# EAGLE design Ethernet J11D (EAGLE 5.04)
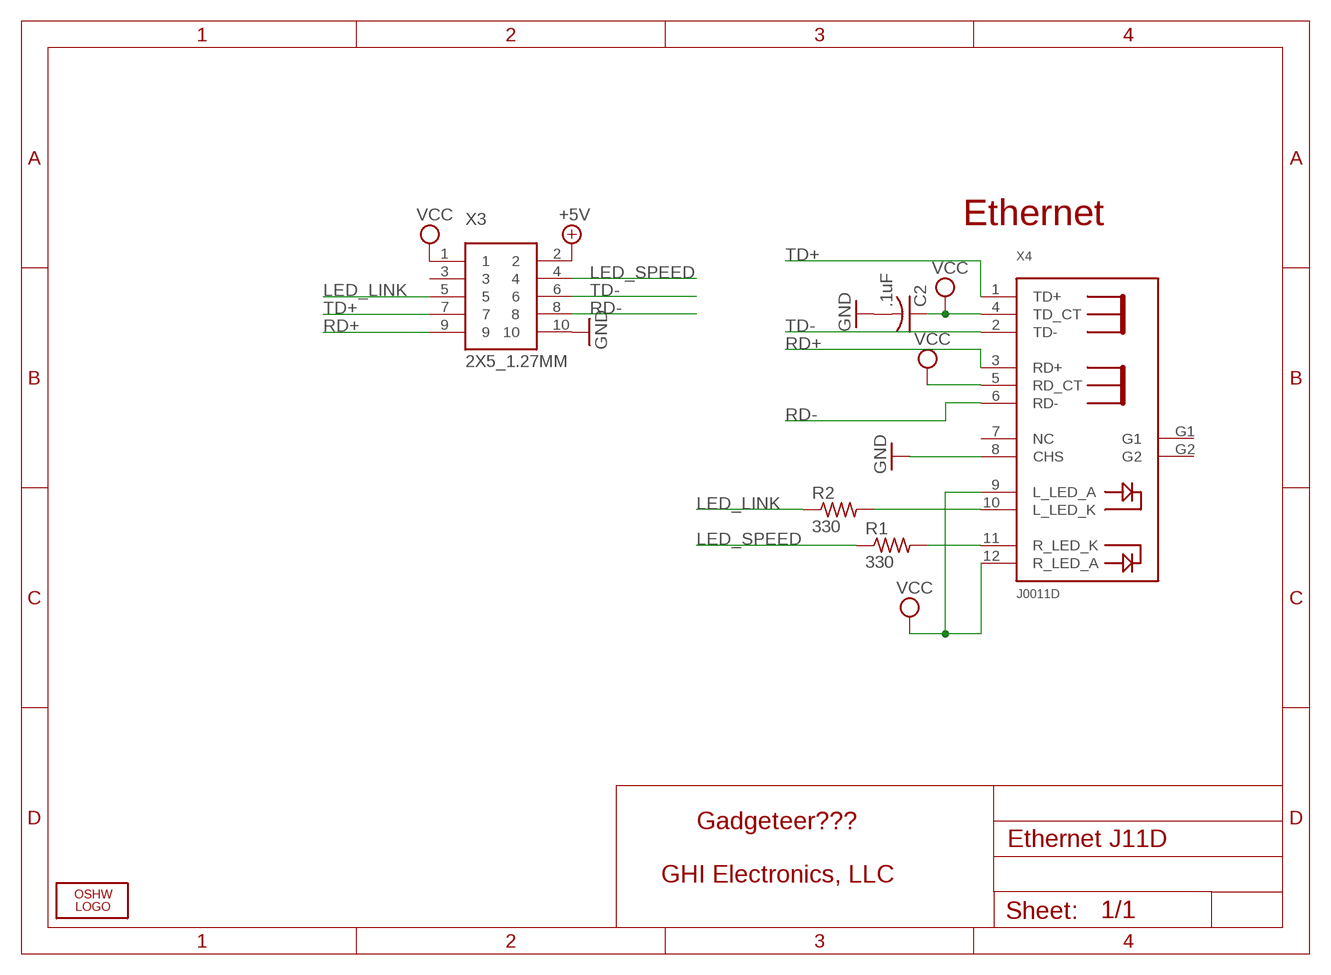
[diagram p0: schematic, sheet 1]

## Parts
C2  .1uF  C-USC0603K  [C0603K]
LOGO1  LOGO-OSHW-FILLX0200-NT  [OSHW_FILLX200_NOTEXT]
R1  330  R-US_R0603  [R0603]
R2  330  R-US_R0603  [R0603]
X3  2X5_1.27MM  [2X5_1.27MM]
X4  J0011D  [LT1S023A]

## Nets
+5V [power]: X3.2
GND [power]: C2.2 X3.10 X4.8(CHS)
LED_LINK [power]: R2.1 X3.5
LED_SPEED: R1.1 X3.4
N$1 [power]: R2.2 X4.10(L_LED_K)
N$4: R1.2 X4.11(R_LED_K)
RD+: X3.9 X4.3(RD+)
RD-: X3.8 X4.6(RD-)
TD+: X3.7 X4.1(TD+)
TD-: X3.6 X4.2(TD-)
VCC [power]: C2.1 X3.1 X4.4(TD_CT) X4.5(RD_CT) X4.9(L_LED_A) X4.12(R_LED_A)
Unconnected: X3.3 X4.7(NC) X4.G1 X4.G2

## Notes on the sheet
- Ethernet
- Gadgeteer???
- GHI Electronics, LLC

## Library data of the parts
C2 = rcl:C-US: CAPACITOR, American symbol
LOGO1 = Logo:LOGO-OSHW-FILL
R1 R2 = rcl:R-US_: RESISTOR, American symbol
X3 = GHI:2X5_1.27MM
X4 = GHI:J0011D

## Net classes
0 default: width 0.254 mm, drill 0.381 mm, clearance 0.203 mm

## Board
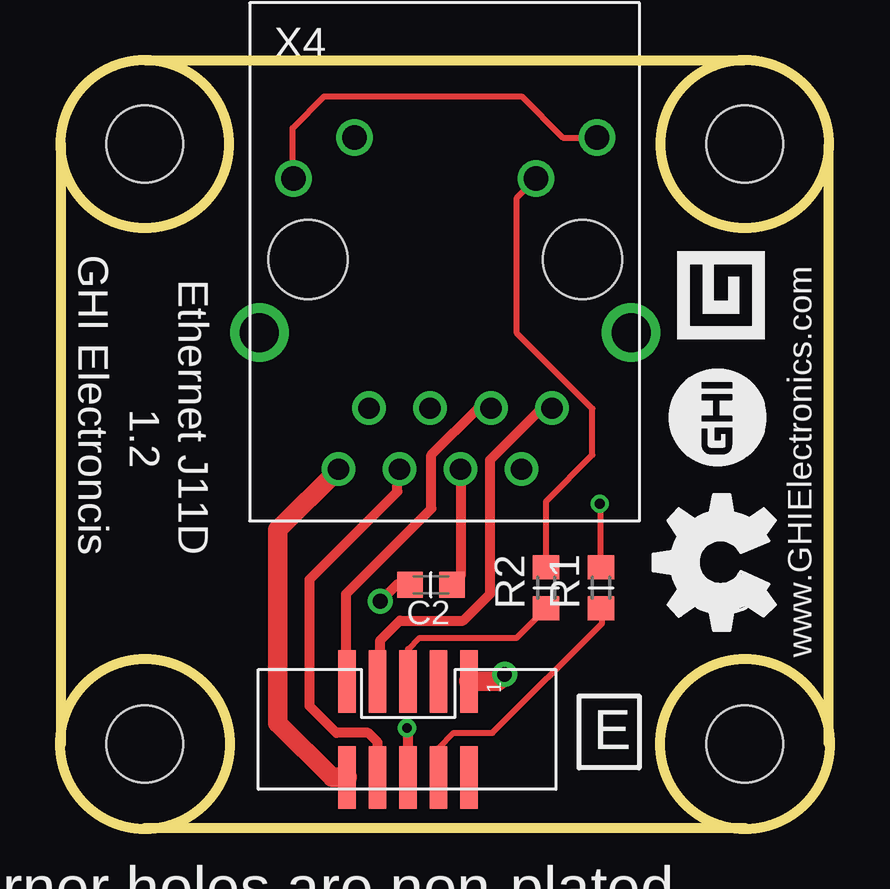
[diagram p1: board, top side]
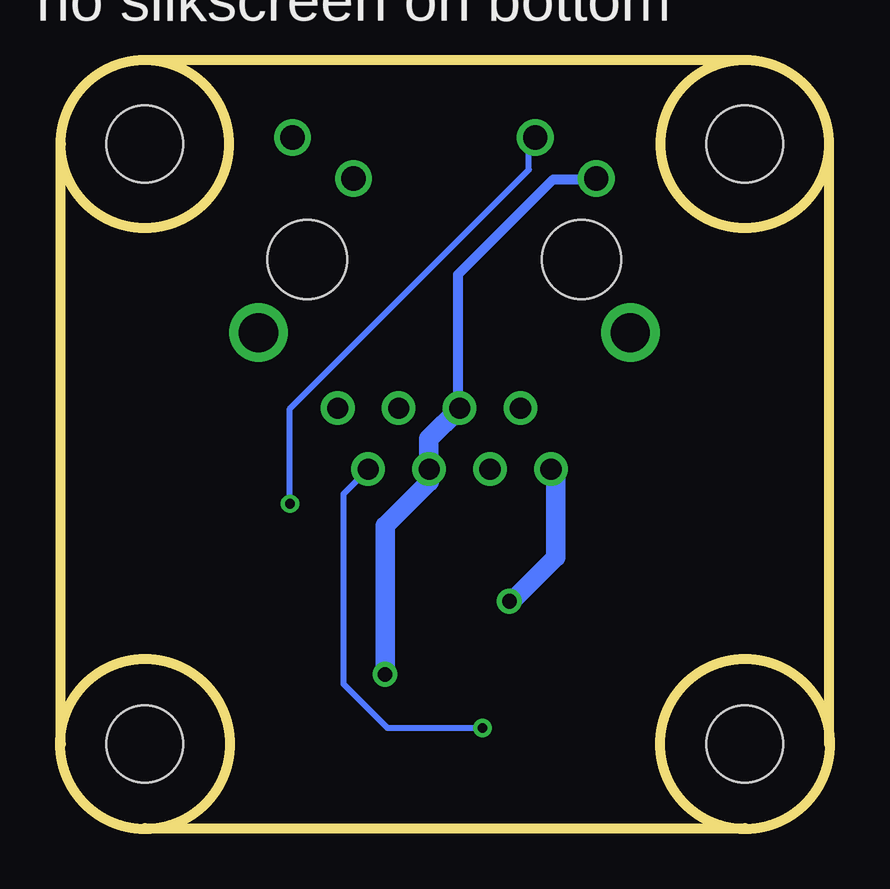
[diagram p2: board, bottom side, seen from below]

Size 32.07 x 32.04 mm. Coordinates in mm from the lower left corner, seen from the top.
Outline: 32.04,3.54 32.04,28.54
Outline: 0.04,28.54 0.04,3.54
Outline: 3.54,32.04 28.54,32.04
Outline: 28.54,0.04 3.54,0.04
Outline: circle at 3.54,28.54 radius 3.5
Outline: circle at 28.54,28.54 radius 3.5
Outline: circle at 28.54,3.54 radius 3.54
Outline: circle at 3.54,3.54 radius 3.54
Copper layers (1+16): Top 0.035mm / dielectric 1.5mm / Bottom 0.035mm
Design rules "default *": minimum track width 8mil, minimum drill 12mil, track to track 8mil, track to pad 8mil, pad to pad 8mil, via to via 8mil, smd to smd 8mil, copper to edge 15mil, drill to drill 8mil, minimum pad ring 10mil, minimum via ring 7mil, stop-mask expansion 4mil, vias tented up to drill 50mil, thermal gap 10mil
Holes 3.2 mm at 3.54,3.54 28.54,28.54 3.54,28.54 28.54,3.54

### Footprints (pad centres in the part's own frame; a part is rotated, then mirrored left to right if it is on the bottom)
C0603K = smd 1.05 x 1.08: 1 -0.875,0; 2 0.875,0
R0603 = smd 1 x 1.1: 1 -0.85,0; 2 0.85,0
2X5_1.27MM = smd 2.6 x 0.74: 1 -2,2.58; 2 2,2.58; 3 -2,1.31; 4 2,1.31; 5 -2,0.04; 6 2,0.04; 7 -2,-1.23; 8 2,-1.23; 9 -2,-2.5; 10 2,-2.5
LT1S023A = drill 0.889 round: 1 4.47,-6.477; 2 3.2,-9.017; 3 1.93,-6.477; 4 0.66,-9.017; 5 -0.61,-6.477; 6 -1.88,-9.017; 7 -3.15,-6.477; 8 -4.42,-9.017 | drill 1.016 round: 9 6.35,4.801; 10 3.81,3.099; 11 -3.759,4.801; 12 -6.299,3.099 | drill 1.626 round: G1 -7.722,-3.327; G2 7.772,-3.327 | hole 3.302: -5.69,-0.279; 5.74,-0.279

### Placement (x,y rotation side)
C2  15.46,10.17 180 top
LOGO1  29.8,8.27 90 top
R1  22.54,10.04 90 top
R2  20.25,10.04 90 top
X3  14.46,4.14 270 top
X4  16.03,24 0 top

### Tracks (layer width: path | path; a pad name or v marks a point on that pad's centre or on a via)
GND  (via drill 0.61)
  Top 0.406: C2.2 14.03,10.17 v13.35,9.48
  Top 0.813: X3.10 11.34,2.14 9.08,4.4 9.08,12.46 X4.8
  Bottom 0.813: v13.35,9.48 13.24,9.48 11.41,11.31 11.41,14.79 X4.8
LED_LINK
  Top 0.254: X3.5 14.5,7.49 14.97,7.96 19.02,7.96 R2.1
LED_SPEED
  Top 0.254: X3.4 15.77,3.38 16.39,4 18.02,4 22.59,8.57 22.59,9.14 R1.1
N$1
  Top 0.254: R2.2 20.25,13.65 22.18,15.58 22.18,17.51 19.03,20.66 19.03,26.3 X4.10
N$4  (via drill 0.41)
  Top 0.254: R1.2 22.54,13.5 v22.49,13.55
  Bottom 0.254: v22.49,13.55 22.49,17.51 12.53,27.47 12.53,28.54 X4.11
RD+
  Top 0.406: X4.3 17.42,17.53 15.48,15.58 15.48,13.35 11.92,9.79 11.92,6.18 X3.9
RD-
  Top 0.406: X3.8 13.23,3.6 12.84,4 11.52,4 10.4,5.12 10.4,10.4 14.06,14.06 14.06,14.89 X4.6
TD+
  Top 0.406: X4.1 20.07,17.53 17.92,15.38 17.92,9.79 16.8,8.67 14.16,8.67 13.35,7.86 13.35,6.26 X3.7
TD-  (via drill 0.41)
  Top 0.406: X3.6 14.5,4.06 v14.46,4.2
  Bottom 0.254: 19.24,14.98 19.24,14.97 20.25,13.95 20.25,6.03 18.43,4.2 v14.46,4.2
  Bottom 0.406: 19.24,14.98 X4.2
VCC  (via drill 0.61)
  Top 0.254: X4.9 20.95,28.8 19.24,30.52 11.01,30.52 9.69,29.19 9.69,27.14 X4.12
  Top 0.406: X4.4 16.69,10.53 C2.1
  Top 0.813: X3.1 18.23,6.14 v18.53,6.44
  Bottom 0.406: X4.12 9.77,27.06 11.52,27.06 15.48,23.1 15.48,17.59 X4.5
  Bottom 0.813: v18.53,6.44 18.53,12.62 16.69,14.46 X4.4 | X4.4 16.69,15.47 16.7,15.48 | 16.7,15.48 16.7,15 X4.4 | 16.7,15.48 16.7,16.25 X4.5

### Text on the board
tPlace: GHI Electroncis | Ethernet J11D | 1.2 | www.GHIElectronics.com | E | corner holes are non-plated | black PCB with white text | do not add any manufacturing codes
bPlace: no silkscreen on bottom